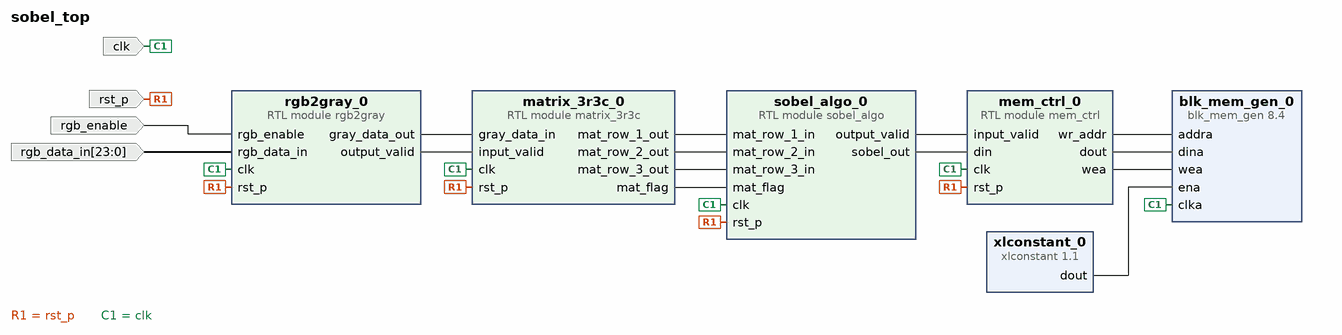
[diagram p0: block diagram of the top level]
# Vivado block design sobel_top, xc7k160tfbg676-1, Vivado 2018.3
create_bd_design sobel_top

create_bd_port -dir I -type clk clk
create_bd_port -dir I rst_p
create_bd_port -dir I rgb_enable
create_bd_port -dir I -from 23 -to 0 rgb_data_in

create_bd_cell -type module -reference rgb2gray rgb2gray_0
create_bd_cell -type module -reference matrix_3r3c matrix_3r3c_0
create_bd_cell -type module -reference sobel_algo sobel_algo_0
create_bd_cell -type ip -vlnv xilinx.com:ip:blk_mem_gen:8.4 blk_mem_gen_0
set_property -dict [list \
  CONFIG.Enable_32bit_Address false \
  CONFIG.Read_Width_A 1 \
  CONFIG.Register_PortA_Output_of_Memory_Primitives true \
  CONFIG.Use_Byte_Write_Enable false \
  CONFIG.Use_RSTA_Pin false \
  CONFIG.Write_Depth_A 9 \
  CONFIG.Write_Width_A 1 \
  CONFIG.use_bram_block Stand_Alone \
] [get_bd_cells blk_mem_gen_0]
create_bd_cell -type ip -vlnv xilinx.com:ip:xlconstant:1.1 xlconstant_0
create_bd_cell -type module -reference mem_ctrl mem_ctrl_0

# ---- connections ----

connect_bd_net -net rst_p_0_1 [get_bd_ports rst_p] \
  [get_bd_pins rgb2gray_0/rst_p] [get_bd_pins matrix_3r3c_0/rst_p] [get_bd_pins sobel_algo_0/rst_p] \
  [get_bd_pins mem_ctrl_0/rst_p]
connect_bd_net -net rgb_enable_0_1 [get_bd_ports rgb_enable] [get_bd_pins rgb2gray_0/rgb_enable]
connect_bd_net -net rgb_data_in_0_1 [get_bd_ports rgb_data_in] [get_bd_pins rgb2gray_0/rgb_data_in]
connect_bd_net [get_bd_pins rgb2gray_0/gray_data_out] [get_bd_pins matrix_3r3c_0/gray_data_in]
connect_bd_net [get_bd_pins rgb2gray_0/output_valid] [get_bd_pins matrix_3r3c_0/input_valid]
connect_bd_net [get_bd_pins matrix_3r3c_0/mat_row_1_out] [get_bd_pins sobel_algo_0/mat_row_1_in]
connect_bd_net [get_bd_pins matrix_3r3c_0/mat_row_2_out] [get_bd_pins sobel_algo_0/mat_row_2_in]
connect_bd_net [get_bd_pins matrix_3r3c_0/mat_row_3_out] [get_bd_pins sobel_algo_0/mat_row_3_in]
connect_bd_net [get_bd_pins matrix_3r3c_0/mat_flag] [get_bd_pins sobel_algo_0/mat_flag]
connect_bd_net [get_bd_ports clk] \
  [get_bd_pins rgb2gray_0/clk] [get_bd_pins matrix_3r3c_0/clk] [get_bd_pins sobel_algo_0/clk] [get_bd_pins mem_ctrl_0/clk] \
  [get_bd_pins blk_mem_gen_0/clka]
connect_bd_net [get_bd_pins sobel_algo_0/output_valid] [get_bd_pins mem_ctrl_0/input_valid]
connect_bd_net [get_bd_pins sobel_algo_0/sobel_out] [get_bd_pins mem_ctrl_0/din]
connect_bd_net [get_bd_pins mem_ctrl_0/wr_addr] [get_bd_pins blk_mem_gen_0/addra]
connect_bd_net [get_bd_pins mem_ctrl_0/dout] [get_bd_pins blk_mem_gen_0/dina]
connect_bd_net [get_bd_pins mem_ctrl_0/wea] [get_bd_pins blk_mem_gen_0/wea]
connect_bd_net [get_bd_pins xlconstant_0/dout] [get_bd_pins blk_mem_gen_0/ena]

validate_bd_design
save_bd_design
